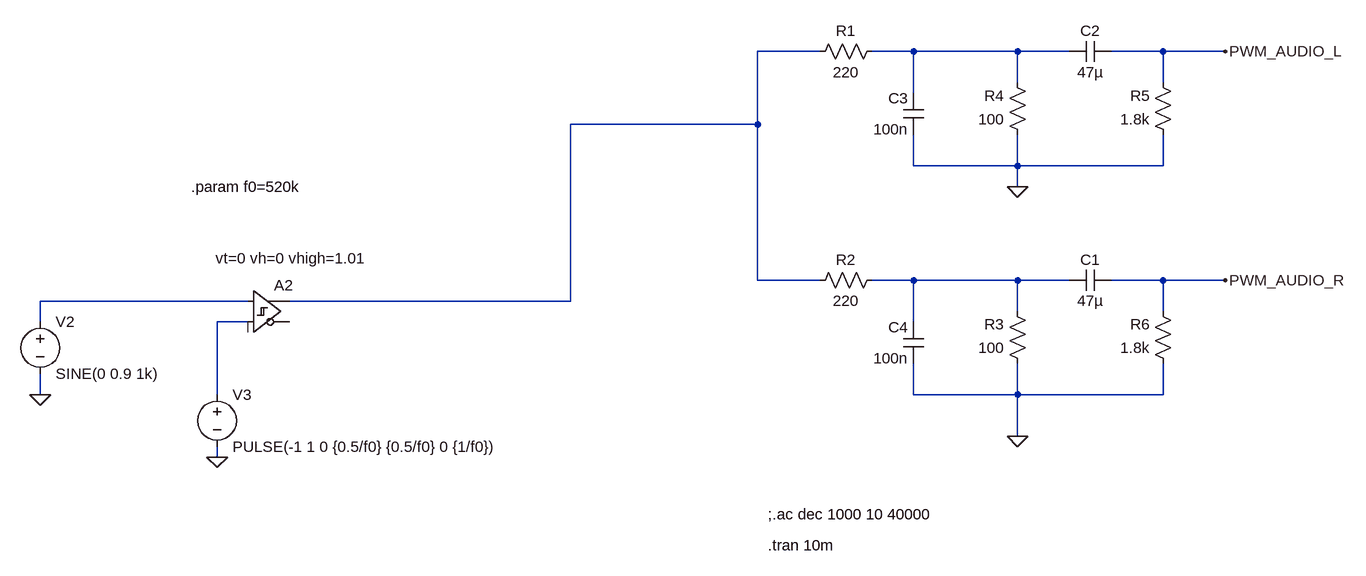
[diagram p0: schematic PWM_Audio.asc]
PWM_Audio.asc, the LTspice schematic file:
Version 4
SHEET 1 1176 760
WIRE 48 -16 -48 -16
WIRE 192 -16 128 -16
WIRE 352 -16 192 -16
WIRE 432 -16 352 -16
WIRE 576 -16 496 -16
WIRE 672 -16 576 -16
WIRE 352 32 352 -16
WIRE 576 32 576 -16
WIRE 192 48 192 -16
WIRE -48 96 -48 -16
WIRE -48 96 -336 96
WIRE 192 160 192 112
WIRE 352 160 352 112
WIRE 352 160 192 160
WIRE 576 160 576 112
WIRE 576 160 352 160
WIRE 352 192 352 160
WIRE -48 336 -48 96
WIRE 48 336 -48 336
WIRE 192 336 128 336
WIRE 352 336 192 336
WIRE 432 336 352 336
WIRE 576 336 496 336
WIRE 672 336 576 336
WIRE -832 368 -1152 368
WIRE -336 368 -336 96
WIRE -336 368 -768 368
WIRE 352 384 352 336
WIRE 576 384 576 336
WIRE -1152 400 -1152 368
WIRE -832 400 -880 400
WIRE 192 400 192 336
WIRE -1152 512 -1152 480
WIRE -880 512 -880 400
WIRE 192 512 192 464
WIRE 352 512 352 464
WIRE 352 512 192 512
WIRE 576 512 576 464
WIRE 576 512 352 512
WIRE 352 576 352 512
WIRE -880 608 -880 592
FLAG 672 -16 PWM_AUDIO_L
FLAG 672 336 PWM_AUDIO_R
FLAG 352 576 0
FLAG 352 192 0
FLAG -1152 512 0
FLAG -880 608 0
SYMBOL res 144 320 R90
WINDOW 0 0 56 VBottom 2
WINDOW 3 32 56 VTop 2
SYMATTR InstName R2
SYMATTR Value 220
SYMBOL res 368 480 R180
WINDOW 0 36 76 Left 2
WINDOW 3 36 40 Left 2
SYMATTR InstName R3
SYMATTR Value 100
SYMBOL res 592 480 R180
WINDOW 0 36 76 Left 2
WINDOW 3 36 40 Left 2
SYMATTR InstName R6
SYMATTR Value 1.8k
SYMBOL cap 496 320 R90
WINDOW 0 0 32 VBottom 2
WINDOW 3 32 32 VTop 2
SYMATTR InstName C1
SYMATTR Value 47µ
SYMBOL cap 208 464 R180
WINDOW 0 24 56 Left 2
WINDOW 3 24 8 Left 2
SYMATTR InstName C4
SYMATTR Value 100n
SYMBOL res 144 -32 R90
WINDOW 0 0 56 VBottom 2
WINDOW 3 32 56 VTop 2
SYMATTR InstName R1
SYMATTR Value 220
SYMBOL res 368 128 R180
WINDOW 0 36 76 Left 2
WINDOW 3 36 40 Left 2
SYMATTR InstName R4
SYMATTR Value 100
SYMBOL res 592 128 R180
WINDOW 0 36 76 Left 2
WINDOW 3 36 40 Left 2
SYMATTR InstName R5
SYMATTR Value 1.8k
SYMBOL cap 496 -32 R90
WINDOW 0 0 32 VBottom 2
WINDOW 3 32 32 VTop 2
SYMATTR InstName C2
SYMATTR Value 47µ
SYMBOL cap 208 112 R180
WINDOW 0 24 56 Left 2
WINDOW 3 24 8 Left 2
SYMATTR InstName C3
SYMATTR Value 100n
SYMBOL voltage -1152 384 R0
WINDOW 123 0 0 Left 0
WINDOW 39 0 0 Left 0
SYMATTR InstName V2
SYMATTR Value SINE(0 0.9 1k)
SYMBOL Digital\\diffschmitt -832 320 R0
WINDOW 3 -50 -18 Left 2
SYMATTR Value vt=0 vh=0 vhigh=1.01
SYMATTR InstName A2
SYMBOL voltage -880 496 R0
WINDOW 123 0 0 Left 0
WINDOW 39 0 0 Left 0
SYMATTR InstName V3
SYMATTR Value PULSE(-1 1 0 {0.5/f0} {0.5/f0} 0 {1/f0})
TEXT -32 696 Left 2 !;.ac dec 1000 10 40000
TEXT -32 744 Left 2 !.tran 10m
TEXT -920 192 Left 2 !.param f0=520k

The netlist it stands for:
* PWM_Audio.asc
R2 N003 N001 220
R3 0 N003 100
R6 0 PWM_AUDIO_R 1.8k
C1 PWM_AUDIO_R N003 47µ
C4 0 N003 100n
R1 N002 N001 220
R4 0 N002 100
R5 0 PWM_AUDIO_L 1.8k
C2 PWM_AUDIO_L N002 47µ
C3 0 N002 100n
V2 N004 0 SINE(0 0.9 1k)
A2 N004 N005 0 0 0 0 N001 0 SCHMITT vt=0 vh=0 vhigh=1.01
V3 N005 0 PULSE(-1 1 0 {0.5/f0} {0.5/f0} 0 {1/f0})
;.ac dec 1000 10 40000
.tran 10m
.param f0=520k
.backanno
.end